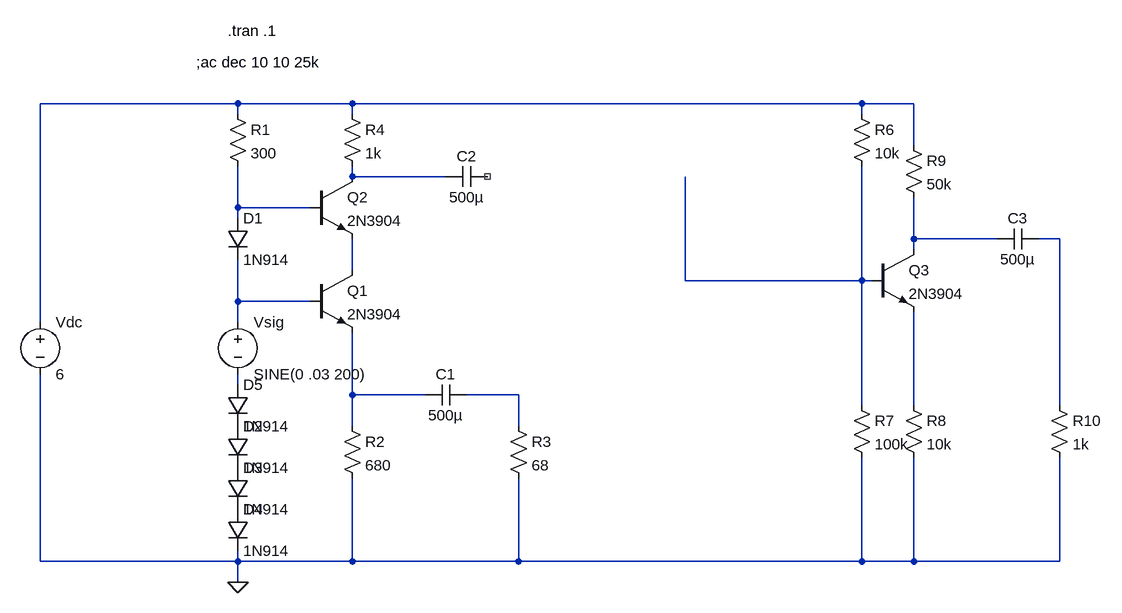
[diagram p0: schematic Draft1.asc]
Draft1.asc, the LTspice schematic file:
Version 4
SHEET 1 1708 680
WIRE 80 -112 -224 -112
WIRE 256 -112 80 -112
WIRE 1040 -112 256 -112
WIRE 1120 -112 1040 -112
WIRE 80 -96 80 -112
WIRE 256 -96 256 -112
WIRE 1040 -96 1040 -112
WIRE 1120 -48 1120 -112
WIRE 256 0 256 -16
WIRE 400 0 256 0
WIRE 80 48 80 -16
WIRE 192 48 80 48
WIRE 80 64 80 48
WIRE 1120 96 1120 32
WIRE 1248 96 1120 96
WIRE 1344 96 1312 96
WIRE 1120 112 1120 96
WIRE 256 144 256 96
WIRE 768 160 768 0
WIRE 1040 160 1040 -16
WIRE 1040 160 768 160
WIRE 1056 160 1040 160
WIRE 80 192 80 128
WIRE 192 192 80 192
WIRE -224 224 -224 -112
WIRE 80 224 80 192
WIRE 80 320 80 304
WIRE 256 336 256 240
WIRE 368 336 256 336
WIRE 512 336 432 336
WIRE 1040 352 1040 160
WIRE 1120 352 1120 208
WIRE 1344 352 1344 96
WIRE 256 384 256 336
WIRE 512 384 512 336
WIRE -224 592 -224 304
WIRE 80 592 80 576
WIRE 80 592 -224 592
WIRE 256 592 256 464
WIRE 256 592 80 592
WIRE 512 592 512 464
WIRE 512 592 256 592
WIRE 1040 592 1040 432
WIRE 1040 592 512 592
WIRE 1120 592 1120 432
WIRE 1120 592 1040 592
WIRE 1344 592 1344 432
WIRE 1344 592 1120 592
WIRE 80 624 80 592
FLAG 80 624 0
SYMBOL voltage 80 208 R0
SYMATTR InstName Vsig
SYMATTR Value SINE(0 .03 200)
SYMATTR Value2 AC 1
SYMBOL voltage -224 208 R0
SYMATTR InstName Vdc
SYMATTR Value 6
SYMBOL diode 64 64 R0
SYMATTR InstName D1
SYMATTR Value 1N914
SYMBOL res 64 -112 R0
SYMATTR InstName R1
SYMATTR Value 300
SYMBOL res 240 368 R0
SYMATTR InstName R2
SYMATTR Value 680
SYMBOL res 496 368 R0
SYMATTR InstName R3
SYMATTR Value 68
SYMBOL cap 432 320 R90
WINDOW 0 0 32 VBottom 2
WINDOW 3 32 32 VTop 2
SYMATTR InstName C1
SYMATTR Value 500µ
SYMBOL npn 192 144 R0
SYMATTR InstName Q1
SYMATTR Value 2N3904
SYMBOL npn 192 0 R0
SYMATTR InstName Q2
SYMATTR Value 2N3904
SYMBOL res 240 -112 R0
SYMATTR InstName R4
SYMATTR Value 1k
SYMBOL diode 64 384 R0
SYMATTR InstName D2
SYMATTR Value 1N914
SYMBOL diode 64 448 R0
SYMATTR InstName D3
SYMATTR Value 1N914
SYMBOL diode 64 512 R0
SYMATTR InstName D4
SYMATTR Value 1N914
SYMBOL diode 64 320 R0
SYMATTR InstName D5
SYMATTR Value 1N914
SYMBOL cap 464 -16 R90
WINDOW 0 0 32 VBottom 2
WINDOW 3 32 32 VTop 2
SYMATTR InstName C2
SYMATTR Value 500µ
SYMBOL res 1024 -112 R0
SYMATTR InstName R6
SYMATTR Value 10k
SYMBOL npn 1056 112 R0
SYMATTR InstName Q3
SYMATTR Value 2N3904
SYMBOL res 1024 336 R0
SYMATTR InstName R7
SYMATTR Value 100k
SYMBOL res 1104 336 R0
SYMATTR InstName R8
SYMATTR Value 10k
SYMBOL res 1104 -64 R0
SYMATTR InstName R9
SYMATTR Value 50k
SYMBOL cap 1312 80 R90
WINDOW 0 0 32 VBottom 2
WINDOW 3 32 32 VTop 2
SYMATTR InstName C3
SYMATTR Value 500µ
SYMBOL res 1328 336 R0
SYMATTR InstName R10
SYMATTR Value 1k
TEXT 64 -224 Left 2 !.tran .1
TEXT 16 -176 Left 2 !;ac dec 10 10 25k

The netlist it stands for:
* Draft1.asc
Vsig N008 N009 SINE(0 .03 200) AC 1
Vdc N001 0 6
D1 N003 N008 1N914
R1 N001 N003 300
R2 N010 0 680
R3 N011 0 68
C1 N011 N010 500µ
Q1 N006 N008 N010 0 2N3904
Q2 N002 N003 N006 0 2N3904
R4 N001 N002 1k
D2 P001 P002 1N914
D3 P002 P003 1N914
D4 P003 0 1N914
D5 N009 P001 1N914
C2 NC_01 N002 500µ
R6 N001 N007 10k
Q3 N004 N007 N012 0 2N3904
R7 N007 0 100k
R8 N012 0 10k
R9 N001 N004 50k
C3 N005 N004 500µ
R10 N005 0 1k
.model D D
.lib standard.dio
.model NPN NPN
.model PNP PNP
.lib standard.bjt
.tran .1
;ac dec 10 10 25k
.backanno
.end